# EAGLE schematic PickupDriverV3.3_v32 (EAGLE 9.7.0)
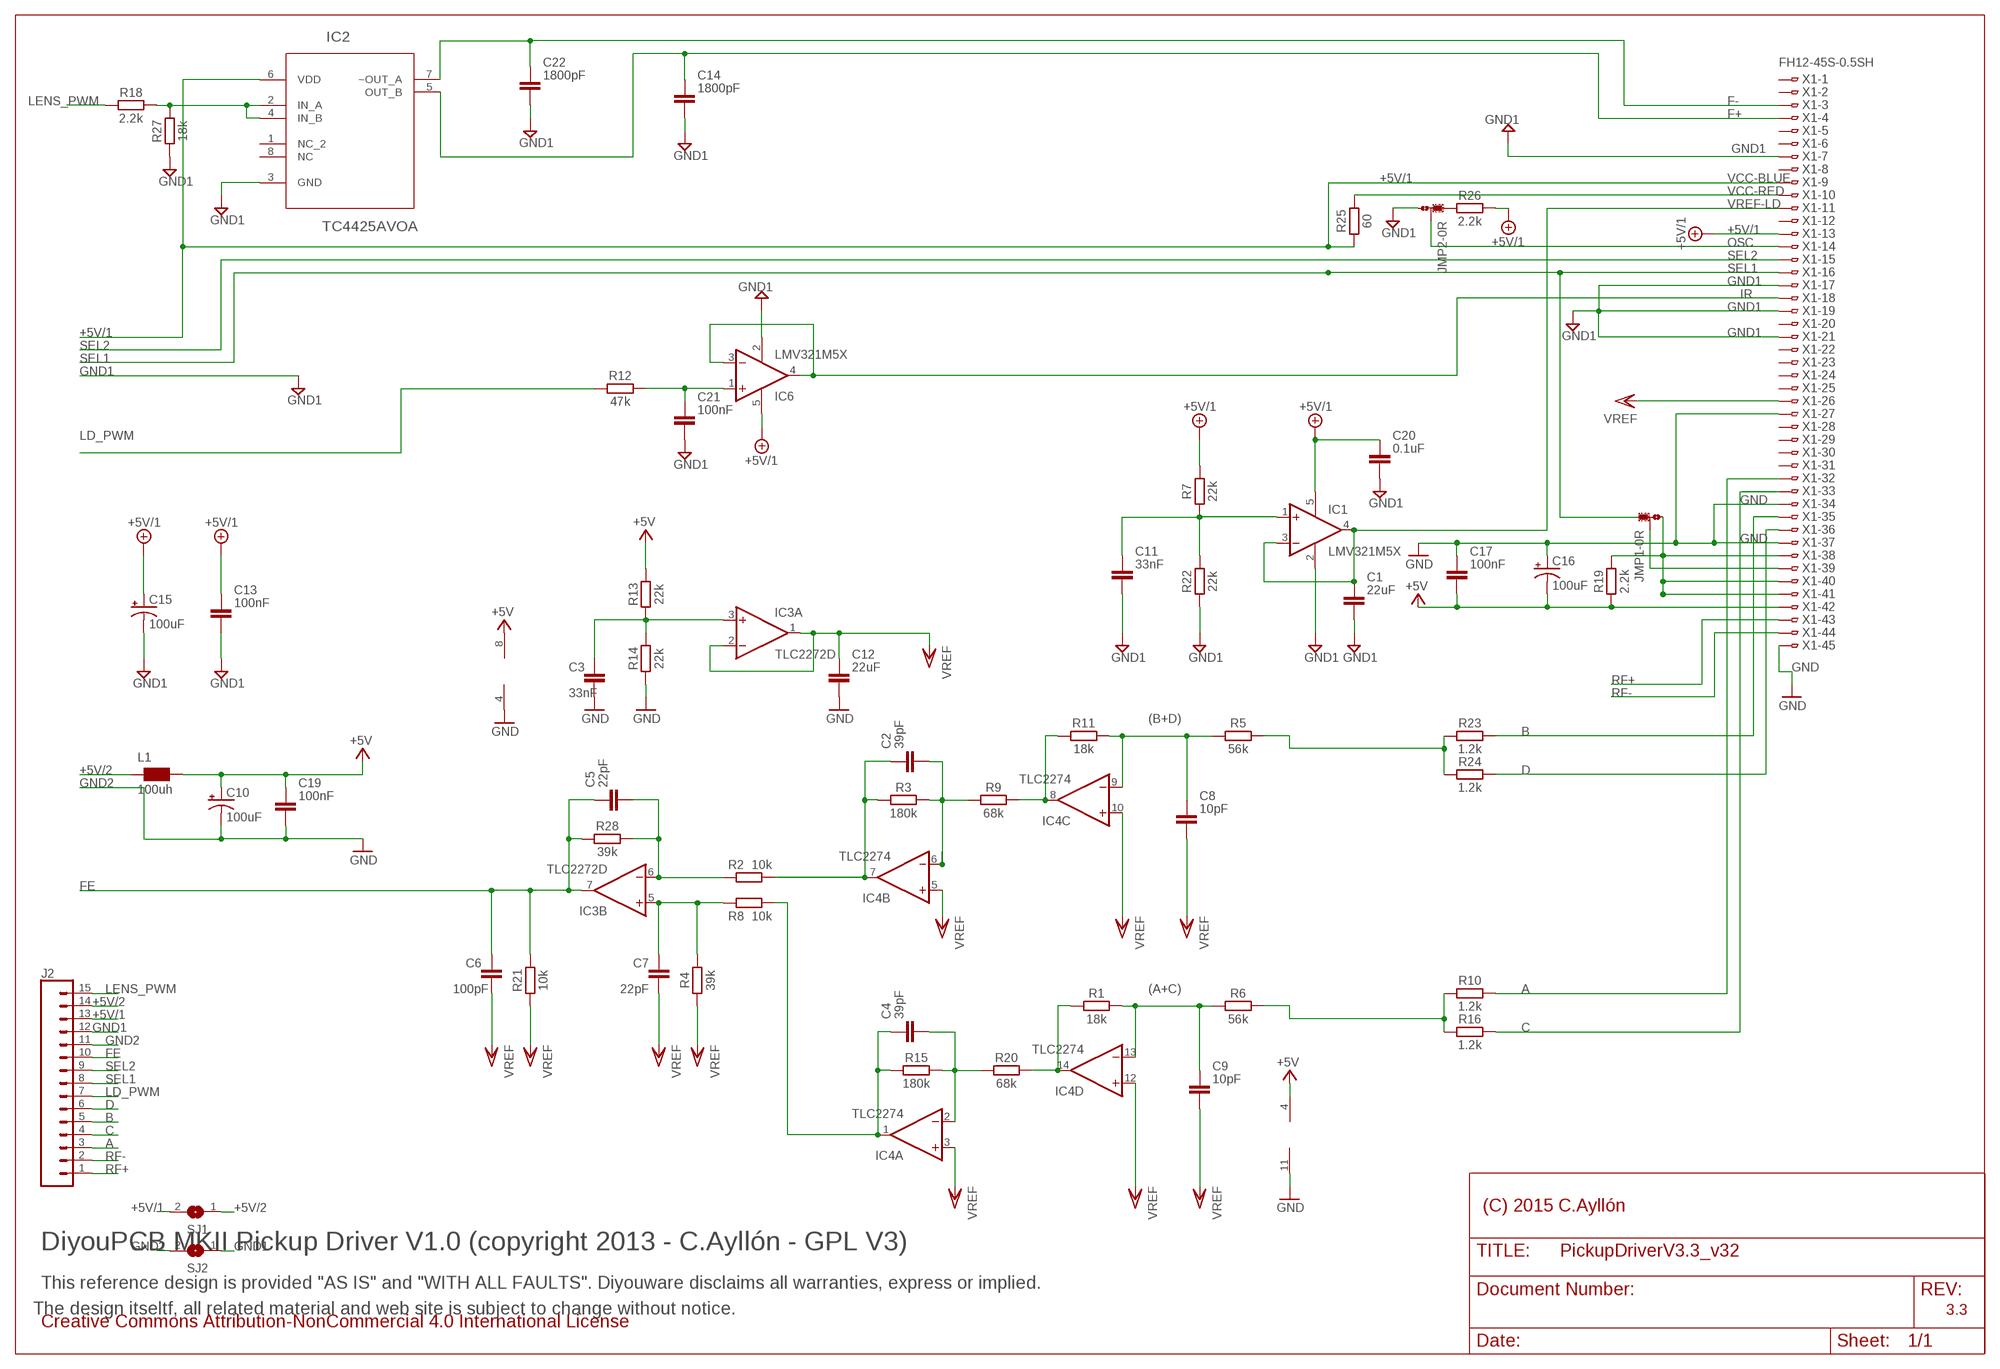
[diagram p0: schematic, sheet 1]

## Parts
C1  22uF  C_CHIP-0603(1608-METRIC)  [CAPC1608X85]
C2  39pF  C_CHIP-0603(1608-METRIC)  [CAPC1608X85]
C3  33nF  C_CHIP-0603(1608-METRIC)  [CAPC1608X85]
C4  39pF  C_CHIP-0603(1608-METRIC)  [CAPC1608X85]
C5  22pF  C_CHIP-0603(1608-METRIC)  [CAPC1608X85]
C6  100pF  C_CHIP-0603(1608-METRIC)  [CAPC1608X85]
C7  22pF  C_CHIP-0603(1608-METRIC)  [CAPC1608X85]
C8  10pF  C_CHIP-0603(1608-METRIC)  [CAPC1608X85]
C9  10pF  C_CHIP-0603(1608-METRIC)  [CAPC1608X85]
C10  100uF  100UF-POLAR-RADIAL-2.5MM-25V-20%  [CPOL-RADIAL-2.5MM-6.5MM]
C11  33nF  C_CHIP-0603(1608-METRIC)  [CAPC1608X85]
C12  22uF  C_CHIP-0603(1608-METRIC)  [CAPC1608X85]
C13  100nF  C_CHIP-0603(1608-METRIC)  [CAPC1608X85]
C14  1800pF  C_CHIP-0603(1608-METRIC)  [CAPC1608X85]
C15  100uF  100UF-POLAR-RADIAL-2.5MM-25V-20%  [CPOL-RADIAL-2.5MM-6.5MM]
C16  100uF  100UF-POLAR-RADIAL-2.5MM-25V-20%  [CPOL-RADIAL-2.5MM-6.5MM]
C17  100nF  C_CHIP-0603(1608-METRIC)  [CAPC1608X85]
C19  100nF  C_CHIP-0603(1608-METRIC)  [CAPC1608X85]
C20  0.1uF  C_CHIP-0603(1608-METRIC)  [CAPC1608X85]
C21  100nF  C_CHIP-0603(1608-METRIC)  [CAPC1608X85]
C22  1800pF  C_CHIP-0603(1608-METRIC)  [CAPC1608X85]
IC1  LMV321M5X  [SOT23-5]
IC2  TC4425AVOA  [SOIC127P600X175-8N]
IC3  TLC2272D  [SO08]
IC4  TLC2274  TLC274D  [SO14]
IC6  LMV321M5X  [SOT23-5]
J2  CONN_15  [1X15]
JMP1  0R-JUMPA  [A0R-JMP]
JMP2  0R-JUMPA  [A0R-JMP]
L1  100uh  CHOKE-100UH  [CHOKE-100UH-1]
R1  18k  R_CHIP-0603(1608-METRIC)  [RESC1608X60]
R2  10k  R_CHIP-0603(1608-METRIC)  [RESC1608X60]
R3  180k  R_CHIP-0603(1608-METRIC)  [RESC1608X60]
R4  39k  R_CHIP-0603(1608-METRIC)  [RESC1608X60]
R5  56k  R_CHIP-0603(1608-METRIC)  [RESC1608X60]
R6  56k  R_CHIP-0603(1608-METRIC)  [RESC1608X60]
R7  22k  R_CHIP-0603(1608-METRIC)  [RESC1608X60]
R8  10k  R_CHIP-0603(1608-METRIC)  [RESC1608X60]
R9  68k  R_CHIP-0603(1608-METRIC)  [RESC1608X60]
R10  1.2k  R_CHIP-0603(1608-METRIC)  [RESC1608X60]
R11  18k  R_CHIP-0603(1608-METRIC)  [RESC1608X60]
R12  47k  R_CHIP-0603(1608-METRIC)  [RESC1608X60]
R13  22k  R_CHIP-0603(1608-METRIC)  [RESC1608X60]
R14  22k  R_CHIP-0603(1608-METRIC)  [RESC1608X60]
R15  180k  R_CHIP-0603(1608-METRIC)  [RESC1608X60]
R16  1.2k  R_CHIP-0603(1608-METRIC)  [RESC1608X60]
R18  2.2k  R_CHIP-0603(1608-METRIC)  [RESC1608X60]
R19  2.2k  R_CHIP-0603(1608-METRIC)  [RESC1608X60]
R20  68k  R_CHIP-0603(1608-METRIC)  [RESC1608X60]
R21  10k  R_CHIP-0603(1608-METRIC)  [RESC1608X60]
R22  22k  R_CHIP-0603(1608-METRIC)  [RESC1608X60]
R23  1.2k  R_CHIP-0603(1608-METRIC)  [RESC1608X60]
R24  1.2k  R_CHIP-0603(1608-METRIC)  [RESC1608X60]
R25  60  R_CHIP-2010(5025-METRIC)  [RESC5025X71]
R26  2.2k  R_CHIP-0603(1608-METRIC)  [RESC1608X60]
R27  18k  R_CHIP-0603(1608-METRIC)  [RESC1608X60]
R28  39k  R_CHIP-0603(1608-METRIC)  [RESC1608X60]
SJ1  SJ  [SJ]
SJ2  SJ  [SJ]
X1  FH12-45S-0.5SH  [FH12-45S-0.5SH]

## Nets
+5V [supply1]: C10.1(+) C16.2(-) C17.2 C19.1 IC3.8(P:V+) IC4.4(P:V+) L1.2 R13.2 R19.1 X1.42
+5V/1 [supply2]: C13.1 C15.1(+) C20.1 IC1.5(V+) IC2.6(VDD) IC6.5(V+) J2.13 R7.2 R25.1 R26.2 SJ1.2 X1.9 X1.13
+5V/2: J2.14 L1.1 SJ1.1
A: J2.3 R10.2 X1.32
B: J2.5 R23.2 X1.35
C: J2.4 R16.2 X1.33
D: J2.6 R24.2 X1.36
F+ [foco]: C14.1 IC2.5(OUT_B) X1.4
F- [foco]: C22.1 IC2.7(~OUT_A) X1.3
FE: C5.1 C6.1 IC3.7(B:OUT) J2.10 R21.2 R28.1
FOCUS: IC2.2(IN_A) IC2.4(IN_B) R18.2 R27.2
GND [supply1]: C3.2 C12.2 C16.1(+) C17.1 IC3.4(P:V-) IC4.11(P:V-) R14.1 X1.27 X1.34 X1.37 X1.45
GND1 [gnd1]: C1.2 C11.2 C13.2 C14.2 C15.2(-) C20.2 C21.2 C22.2 IC1.2(V-) IC2.3(GND) IC6.2(V-) J2.12 JMP2.3 R22.1 R27.1 SJ2.1 X1.7 X1.17 X1.19 X1.21
GND2: C10.2(-) C19.2 J2.11 SJ2.2 ; supply symbol labelled GND
IR: IC6.3(-IN) IC6.4(OUT) X1.18
LD_PWM: J2.7 R12.1
LENS_PWM: J2.15 R18.1
N$1: C11.1 IC1.1(+IN) R7.1 R22.2
N$2: C2.1 IC4.7(B:OUT) R2.2 R3.1
N$3: C21.1 IC6.1(+IN) R12.2
N$4: C8.1 IC4.9(C:-IN) R5.1 R11.2
N$5: IC4.14(D:OUT) R1.1 R20.2
N$6: C3.1 IC3.3(A:+IN) R13.1 R14.2
N$7: IC4.8(C:OUT) R9.2 R11.1
N$8: C9.1 IC4.13(D:-IN) R1.2 R6.1
N$9: C2.2 IC4.6(B:-IN) R3.2 R9.1
N$10: C5.2 IC3.6(B:-IN) R2.1 R28.2
N$11: C7.1 IC3.5(B:+IN) R4.2 R8.1
N$13: JMP2.1 R26.1
N$14: C4.1 IC4.1(A:OUT) R8.2 R15.1
N$15: C4.2 IC4.2(A:-IN) R15.2 R20.1
N$16: R6.2 R10.1 R16.1
N$22: R5.2 R23.1 R24.1
ND: JMP1.3 R19.2 X1.38 X1.40 X1.41
OSC: JMP2.2 X1.14
REDVCC [supply2]: R25.2 X1.10
RF+: J2.1 X1.43
RF-: J2.2 X1.44
SEL1: J2.8 JMP1.1 X1.16
SEL2: J2.9 X1.15
SW: JMP1.2 X1.39
VREF: C6.2 C7.2 C8.2 C9.2 C12.1 IC3.1(A:OUT) IC3.2(A:-IN) IC4.3(A:+IN) IC4.5(B:+IN) IC4.10(C:+IN) IC4.12(D:+IN) R4.1 R21.1 X1.26
VREF-LD: C1.1 IC1.3(-IN) IC1.4(OUT) X1.11
Unconnected: IC2.1(NC_2) IC2.8(NC) X1.1 X1.2 X1.5 X1.6 X1.8 X1.12 X1.20 X1.22 X1.23 X1.24 X1.25 X1.28 X1.29 X1.30 X1.31

## Notes on the sheet
- VCC-BLUE
- VCC-RED
- (B+D)
- (A+C)
- (C) 2015 C.Ayllón
- DiyouPCB MKII Pickup Driver V1.0 (copyright 2013 - C.Ayllón - GPL V3)
- This reference design is provided "AS IS" and "WITH ALL FAULTS". Diyouware disclaims all warranties, express or implied.
- The design itseltf, all related material and web site is subject to change without notice. | 3.3
- Creative Commons Attribution-NonCommercial 4.0 International License

## Library data of the parts
C1-C9 C11-C14 C17 C19-C22 = Capacitor:C: Capacitor - Generic; CATEGORY: Capacitor
C10 C15 C16 = SparkFun-Capacitors:100UF-POLAR: 100µF polarized capacitors A capacitor is a passive two-terminal electrical component used to store electrical energy temporarily in an electric field.; PROD_ID: CAP-08439
IC1 IC6 = linear:LMV321?*: General Purpose, Low Voltage, Rail-to-Rail Output Operational Amplifiers Source: http://www.national.com/mpf/LM/LMV321.html http://www.national.com/dt/lmv_qual.pdf
IC2 = Microchip_By_element14_Batch_1:TC4425AVOA: Dual High-Speed Power MOSFET Drivers; DESCRIPTION: MOSFET; MPN: TC4425AVOA; OC_FARNELL: 1834904; OC_NEWARK: 56K7426; PACKAGE: SOIC-8; SPICEPREFIX: X; SUPPLIER: Microchip
IC3 = linear:TLC2272: OP AMP
IC4 = linear:TLC274: OP AMP
J2 = SparkFun-Connectors:CONN_15: Multi connection point. Often used as Generic Header-pin footprint for 0.1 inch spaced/style header connections On any of the 0.1 inch spaced packages, you can populate with these: Break Away Headers - Straight <https://www.sparkfun.com/products/116> (PRT-00116) Break Away Male Headers - Right Angle <https://www.sparkfun.com/products/553> (PRT-00553) Female Headers <https://www.sparkfun.com/products/115> (PRT-00115) Break Away Headers - Machine Pin <https://www.sparkfun.com/products/117> (PRT-00117) Break Away Female Headers - Swiss Machine Pin <https://www.sparkfun.com/products/743> (PRT-00743) For SCREWTERMINALS and SPRING TERMINALS visit here: Screw Terimnals on SparkFun.com <https://www.sparkfun.com/search/results?term=Screw+Terminals> (5mm/3.5mm/2.54mm spacing) This device is also useful as a general connection point to wire up your design to another part of your project. Our various solder wires solder well into these plated through hole pads. Hook-Up Wire - Assortment (Stranded, 22 AWG) <https://www.sparkfun.com/products/11375> (PRT-11375) Hook-Up Wire - Assortment (Solid Core, 22 AWG) <https://www.sparkfun.com/products/11367> (PRT-11367) View the entire wire category on our website here <https://www.sparkfun.com/categories/141> Special notes: Molex polarized connector foot print use with SKU : PRT-08231 with associated crimp pins and housings. 1MM SMD Version SKU: PRT-10208 NOTES ON THE VARIANTS LOCK and LOCK_LONGPADS... This footprint was designed to help hold the alignment of a through-hole component (i.e. 6-pin header) while soldering it into place. You may notice that each hole has been shifted either up or down by 0.005 of an inch from it's more standard position (which is a perfectly straight line). This slight alteration caused the pins (the squares in the middle) to touch the edges of the holes. Because they are alternating, it causes a "brace" to hold the component in place. 0.005 has proven to be the perfect amount of "off-center" position when using our standard breakaway headers. Although looks a little odd when you look at the bare footprint, once you have a header in there, the alteration is very hard to notice. Also,if you push a header all the way into place, it is covered up entirely on the bottom side.
JMP1 JMP2 = jump-0r-smd:0R-JUMP: SMD 0R 0805 Jumper
L1 = wurth_electronics_midcom_inc_v1-0:CHOKE-100UH
R1-R16 R18-R24 R26-R28 = resistor:R: Resistor Fixed - Generic; CATEGORY: Resistor; SUB-CATEGORY: Fixed
R25 = Resistor:R: Resistor Fixed - Generic; CATEGORY: Resistor; SUB-CATEGORY: Fixed
SJ1 SJ2 = jumper:SJ: SMD solder JUMPER
X1 = con-hirose:FH12-45S-0.5S: 0.5mm Pitch Connectors For FPC/FFC Source: Data sheet <http://www.hirose.co.jp/cataloge_hp/e58605370.pdf>; OC_FARNELL: unknown; OC_NEWARK: unknown

## Net classes
0 default: width 0.254 mm, drill 0.305 mm, clearance 0.127 mm
1 supply1: width 0.305 mm, drill 0.305 mm, clearance 0.127 mm
2 gnd: width 0.305 mm, drill 0.305 mm, clearance 0.127 mm
3 supply2: width 0.305 mm, drill 0.305 mm, clearance 0.127 mm
4 foco: width 0.305 mm, drill 0.305 mm, clearance 0.127 mm
5 gnd1: width 0.305 mm, drill 0.305 mm, clearance 0.127 mm